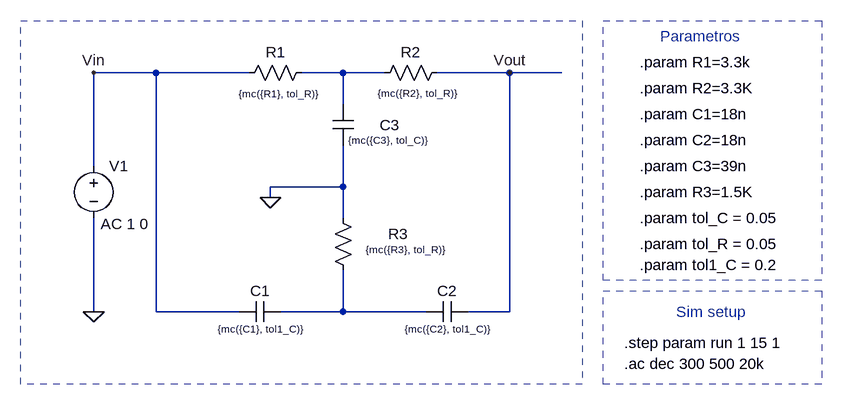
[diagram p0: schematic notchG.asc]
notchG.asc, the LTspice schematic file:
Version 4
SHEET 1 1532 680
WIRE -16 80 -112 80
WIRE 128 80 -16 80
WIRE 272 80 208 80
WIRE 336 80 272 80
WIRE 528 80 416 80
WIRE 608 80 528 80
WIRE 272 128 272 80
WIRE -112 224 -112 80
WIRE 272 256 272 192
WIRE 272 256 160 256
WIRE 160 272 160 256
WIRE 272 304 272 256
WIRE -112 448 -112 304
WIRE -16 448 -16 80
WIRE 112 448 -16 448
WIRE 272 448 272 384
WIRE 272 448 176 448
WIRE 400 448 272 448
WIRE 528 448 528 80
WIRE 528 448 464 448
FLAG 160 272 0
FLAG -112 448 0
FLAG 528 80 Vout
FLAG -112 80 Vin
SYMBOL res 224 64 R90
WINDOW 0 0 56 VBottom 2
WINDOW 3 38 52 VTop 1
SYMATTR InstName R1
SYMATTR Value {mc({R1}, tol_R)}
SYMATTR SpiceLine tol=10
SYMBOL res 432 64 R90
WINDOW 0 0 56 VBottom 2
WINDOW 3 37 46 VTop 1
SYMATTR InstName R2
SYMATTR Value {mc({R2}, tol_R)}
SYMATTR SpiceLine tol=10
SYMBOL res 288 400 R180
WINDOW 0 -84 72 Left 2
WINDOW 3 -140 48 Left 1
SYMATTR InstName R3
SYMATTR Value {mc({R3}, tol_R)}
SYMBOL cap 256 128 R0
WINDOW 0 72 33 Left 2
WINDOW 3 24 56 Left 1
SYMATTR InstName C3
SYMATTR Value {mc({C3}, tol_C)}
SYMBOL cap 176 432 R90
WINDOW 0 0 32 VBottom 2
WINDOW 3 32 32 VTop 1
SYMATTR InstName C1
SYMATTR Value {mc({C1}, tol1_C)}
SYMBOL cap 464 432 R90
WINDOW 0 0 32 VBottom 2
WINDOW 3 32 32 VTop 1
SYMATTR InstName C2
SYMATTR Value {mc({C2}, tol1_C)}
SYMBOL voltage -112 208 R0
WINDOW 3 11 105 Left 2
SYMATTR Value AC 1 0
SYMATTR InstName V1
TEXT 704 528 Left 2 !.ac dec 300 500 20k
TEXT 728 64 Left 2 !.param R1=3.3k
TEXT 728 104 Left 2 !.param R2=3.3K
TEXT 728 144 Left 2 !.param C1=18n
TEXT 728 184 Left 2 !.param C2=18n
TEXT 728 224 Left 2 !.param C3=39n
TEXT 728 264 Left 2 !.param R3=1.5K
TEXT 728 304 Left 2 !.param tol_C = 0.05
TEXT 728 344 Left 2 !.param tol_R = 0.05
TEXT 704 496 Left 2 !.step param run 1 15 1
TEXT 760 24 Left 2 ;Parametros
TEXT 784 448 Left 2 ;Sim setup
TEXT 728 376 Left 2 !.param tol1_C = 0.2
RECTANGLE Normal 640 560 -224 0 2
RECTANGLE Normal 1008 400 672 0 2
RECTANGLE Normal 1008 560 672 416 2

The netlist it stands for:
* notchG.asc
R1 N001 Vin {mc({R1}, tol_R)} tol=10
R2 Vout N001 {mc({R2}, tol_R)} tol=10
R3 N002 0 {mc({R3}, tol_R)}
C3 N001 0 {mc({C3}, tol_C)}
C1 N002 Vin {mc({C1}, tol1_C)}
C2 Vout N002 {mc({C2}, tol1_C)}
V1 Vin 0 AC 1 0
.ac dec 300 500 20k
.param R1=3.3k
.param R2=3.3K
.param C1=18n
.param C2=18n
.param C3=39n
.param R3=1.5K
.param tol_C = 0.05
.param tol_R = 0.05
.step param run 1 15 1
* Parametros
* Sim setup
.param tol1_C = 0.2
.backanno
.end